# EAGLE design MSi001_board (EAGLE 9.6.2)
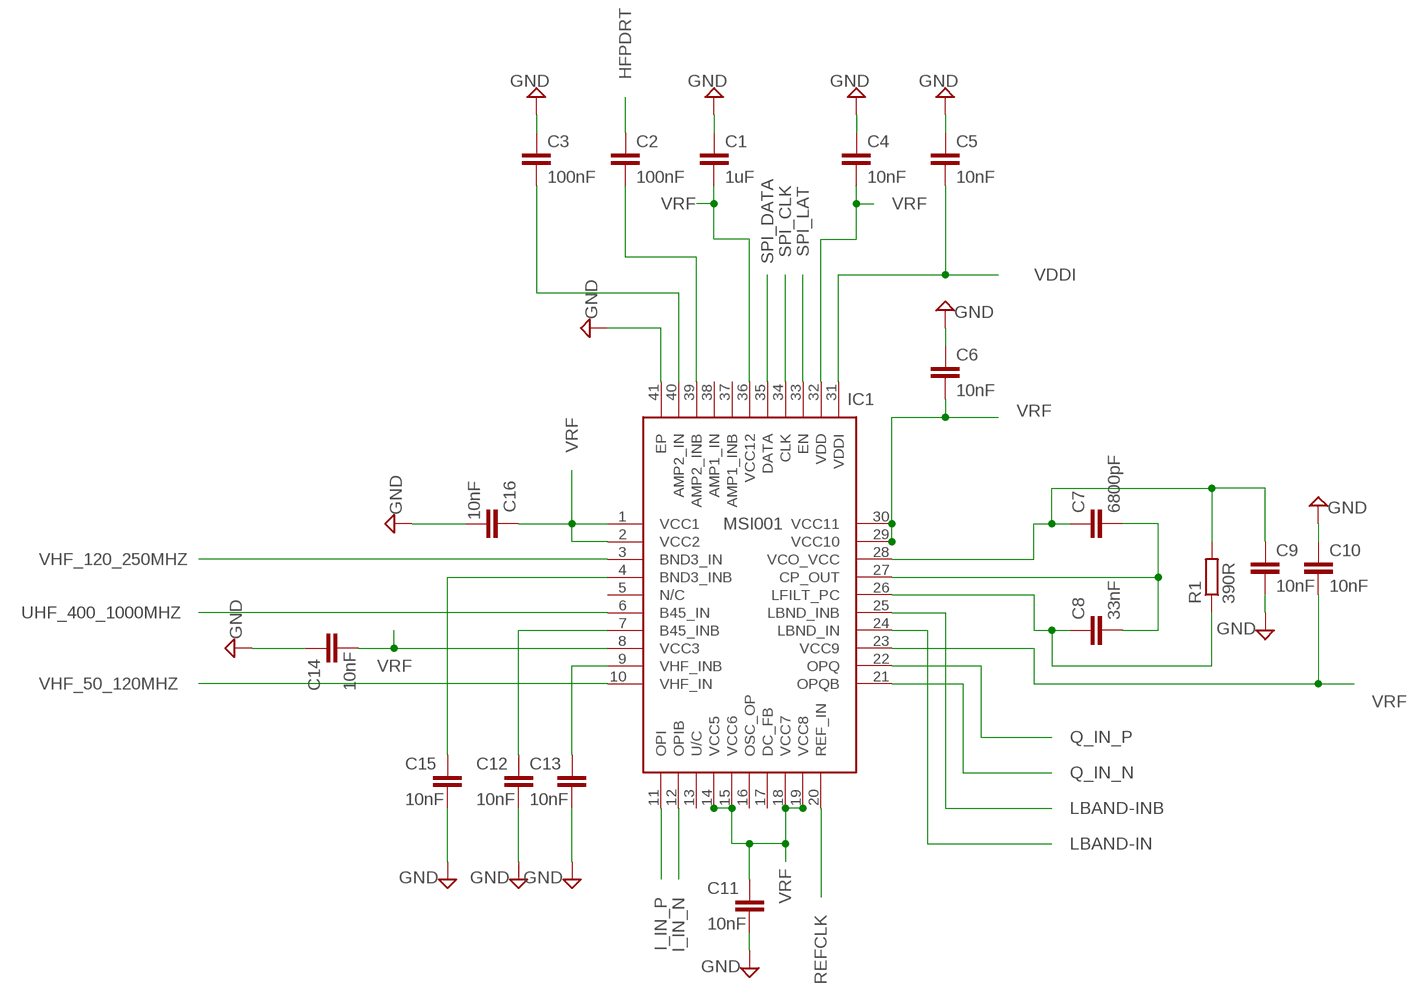
[diagram p0: schematic, sheet 1, part 1 of 2]
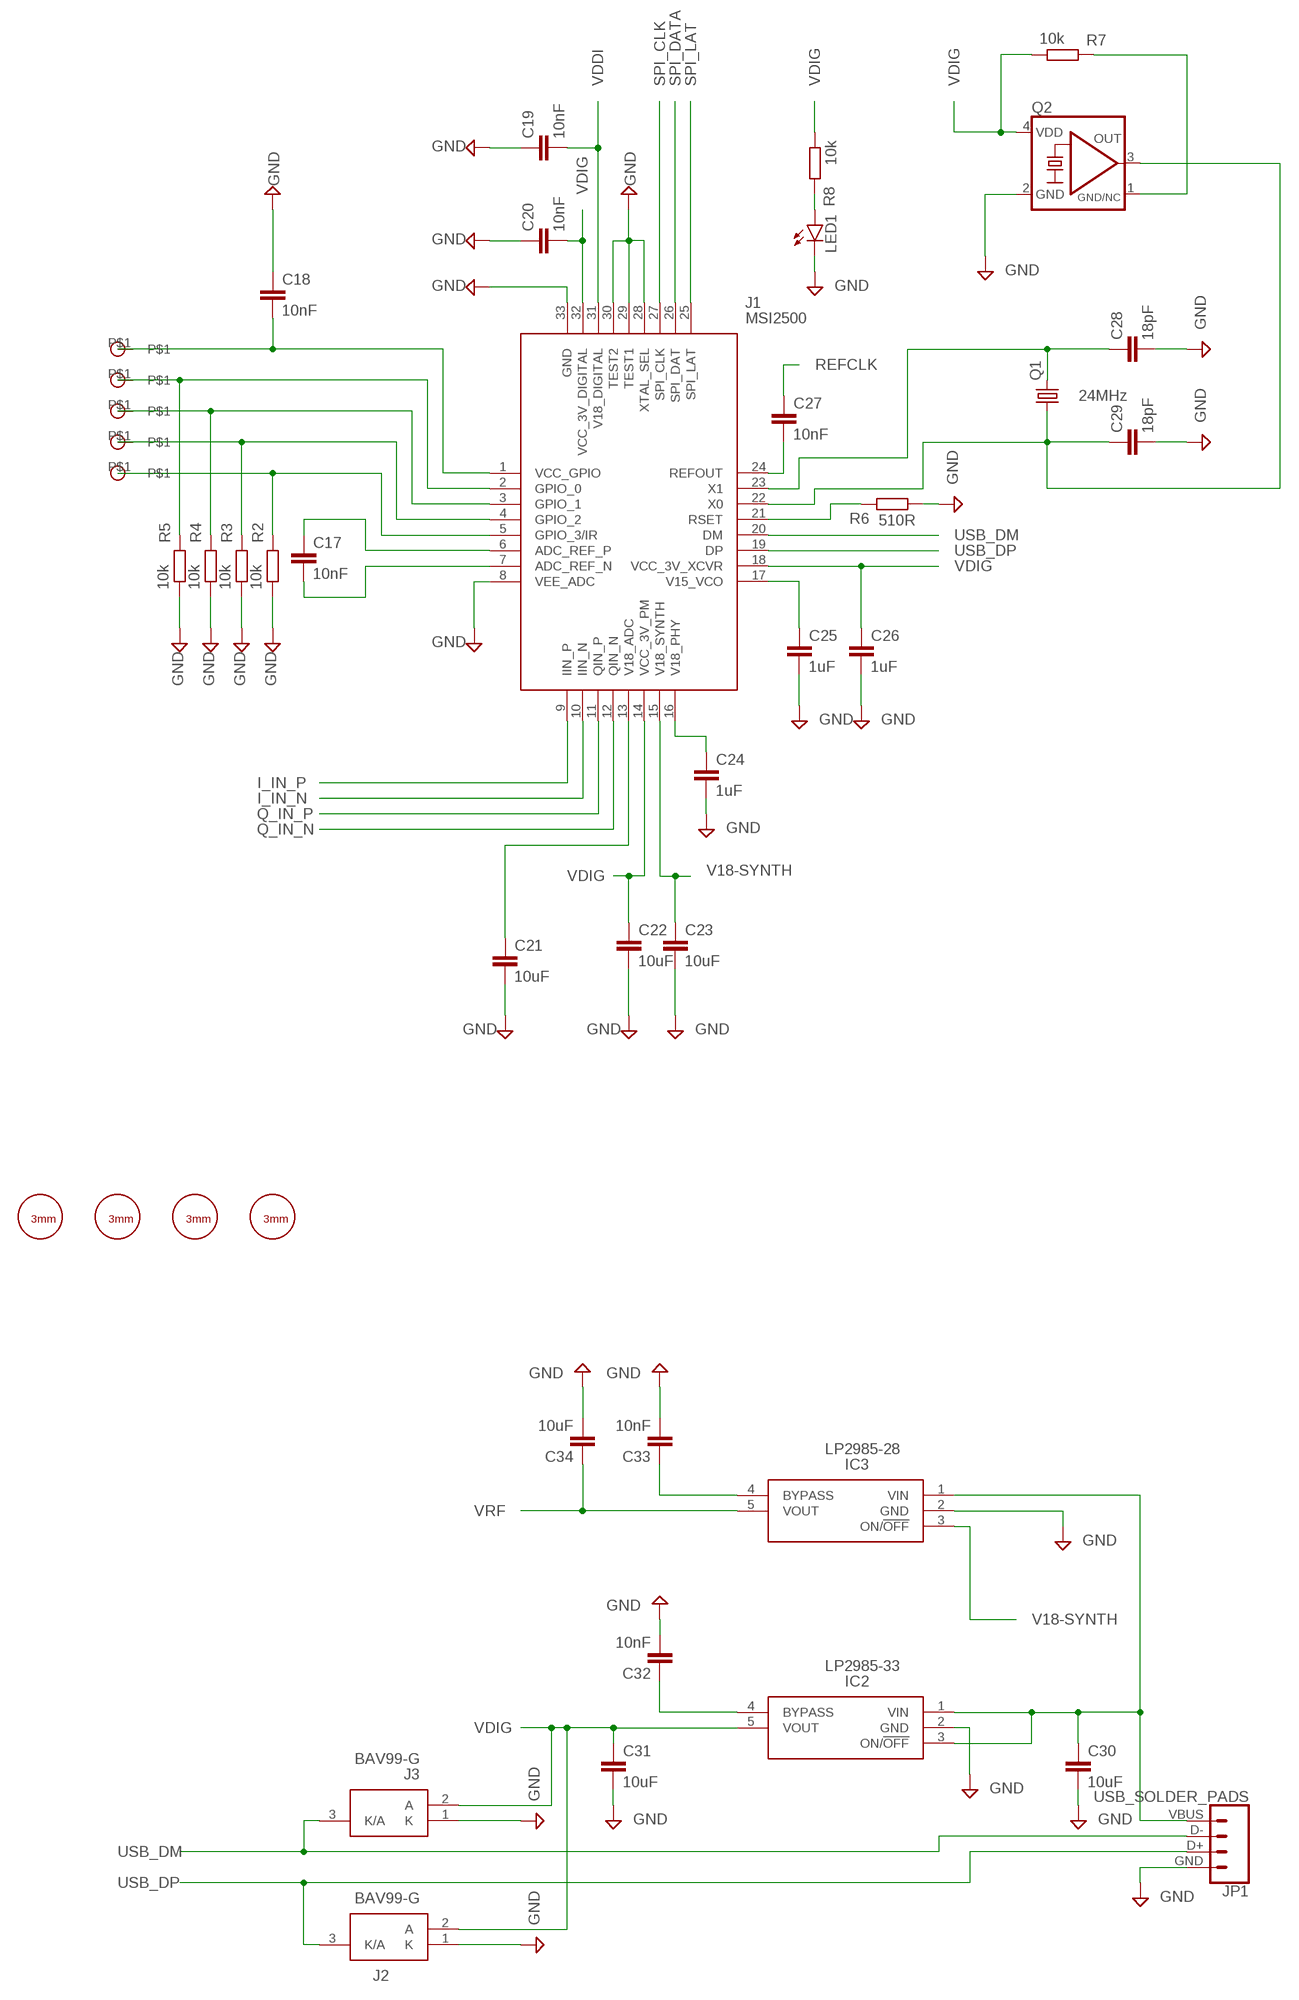
[diagram p1: schematic, sheet 1, part 2 of 2]

## Parts
C1  1uF  C-EUC0805K  [C0805K]
C2  100nF  C-EUC0603K  [C0603K]
C3  100nF  C-EUC0603K  [C0603K]
C4  10nF  C-EUC0603K  [C0603K]
C5  10nF  C-EUC0603K  [C0603K]
C6  10nF  C-EUC0603K  [C0603K]
C7  6800pF  C-EUC0603K  [C0603K]
C8  33nF  C-EUC0603K  [C0603K]
C9  10nF  C-EUC0603K  [C0603K]
C10  10nF  C-EUC0603K  [C0603K]
C11  10nF  C-EUC0603K  [C0603K]
C12  10nF  C-EUC0603K  [C0603K]
C13  10nF  C-EUC0603K  [C0603K]
C14  10nF  C-EUC0603K  [C0603K]
C15  10nF  C-EUC0603K  [C0603K]
C16  10nF  C-EUC0603K  [C0603K]
C17  10nF  C-EUC0603K  [C0603K]
C18  10nF  C-EUC0603K  [C0603K]
C19  10nF  C-EUC0603K  [C0603K]
C20  10nF  C-EUC0603K  [C0603K]
C21  10uF  C-EUC0805K  [C0805K]
C22  10uF  C-EUC0805K  [C0805K]
C23  10uF  C-EUC0805K  [C0805K]
C24  1uF  C-EUC0805K  [C0805K]
C25  1uF  C-EUC0805K  [C0805K]
C26  1uF  C-EUC0805K  [C0805K]
C27  10nF  C-EUC0603K  [C0603K]
C28  18pF  C-EUC0603K  [C0603K]
C29  18pF  C-EUC0603K  [C0603K]
C30  10uF  C-EUC0805K  [C0805K]
C31  10uF  C-EUC0805K  [C0805K]
C32  10nF  C-EUC0603K  [C0603K]
C33  10nF  C-EUC0603K  [C0603K]
C34  10uF  C-EUC0805K  [C0805K]
IC1  MSI001  [QFN50P600X600X90-41N]
IC2  LP2985-33  LP2985-30DBVR  [SOT95P280X145-5N]
IC3  LP2985-28  LP2985-30DBVR  [SOT95P280X145-5N]
J1  MSI2500  [QFN50P500X500X90-33N]
J2  BAV99-G  [SOT97P230X110-3N]
J3  BAV99-G  [SOT97P230X110-3N]
JP1  USB_SOLDER_PADS  [USB-SOLDER-PADS]
LED1  LEDCHIPLED_0805  [CHIPLED_0805]
Q1  24MHz  CRYSTALHC49S  [HC49/S]
Q2  KXO-TCXO-CMOS-83  [5.0X3.2_KXO-83-TCXO]
R1  390R  R-EU_R0603  [R0603]
R2  10k  R-EU_R0603  [R0603]
R3  10k  R-EU_R0603  [R0603]
R4  10k  R-EU_R0603  [R0603]
R5  10k  R-EU_R0603  [R0603]
R6  510R  R-EU_R0603  [R0603]
R7  10k  R-EU_R0603  [R0603]
R8  10k  R-EU_R0603  [R0603]
U$1  3MM_HOLE  [3MM_HOLE]
U$2  SMD_PIN  [SMD_PIN]
U$3  SMD_PIN  [SMD_PIN]
U$4  SMD_PIN  [SMD_PIN]
U$5  SMD_PIN  [SMD_PIN]
U$6  3MM_HOLE  [3MM_HOLE]
U$7  3MM_HOLE  [3MM_HOLE]
U$8  3MM_HOLE  [3MM_HOLE]
VCC_GPIO  SMD_PIN  [SMD_PIN]

## Nets
GND: C1.1 C3.1 C4.1 C5.1 C6.1 C9.2 C10.1 C11.2 C12.2 C13.2 C14.1 C15.2 C16.2 C18.1 C19.1 C20.1 C21.2 C22.2 C23.2 C24.2 C25.2 C26.2 C28.2 C29.2 C30.2 C31.2 C32.2 C33.2 C34.2 IC1.41(EP) IC2.2(GND) IC3.2(GND) J1.8(VEE_ADC) J1.28(XTAL_SEL) J1.29(TEST1) J1.30(TEST2) J1.33(GND) J2.1(K) J3.1(K) JP1.GND LED1.C Q2.2(GND) R2.1 R3.1 R4.1 R5.1 R6.1
HFPDRT: C2.1
I_IN_N: IC1.12(OPIB) J1.10(IIN_N)
I_IN_P: IC1.11(OPI) J1.9(IIN_P)
LBAND-IN: IC1.24(LBND_IN)
LBAND-INB: IC1.25(LBND_INB)
N$1: C2.2 IC1.39(AMP2_INB)
N$2: C3.2 IC1.40(AMP2_IN)
N$3: C7.1 C9.1 IC1.28(VCO_VCC) R1.2
N$4: C8.1 IC1.26(LFILT_PC) R1.1
N$5: C7.2 C8.2 IC1.27(CP_OUT)
N$6: C12.1 IC1.7(B45_INB)
N$7: C13.1 IC1.9(VHF_INB)
N$8: C15.1 IC1.4(BND3_INB)
N$9: C17.2 J1.7(ADC_REF_N)
N$10: C17.1 J1.6(ADC_REF_P)
N$11: C18.2 J1.1(VCC_GPIO) VCC_GPIO.P$1
N$12: J1.2(GPIO_0) R5.2 U$2.P$1
N$13: J1.3(GPIO_1) R4.2 U$3.P$1
N$14: J1.4(GPIO_2) R3.2 U$4.P$1
N$15: J1.5(GPIO_3/IR) R2.2 U$5.P$1
N$16: C21.1 J1.13(V18_ADC)
N$17: C24.1 J1.16(V18_PHY)
N$18: C25.1 J1.17(V15_VCO)
N$19: J1.21(RSET) R6.2
N$20: C27.2 J1.24(REFOUT)
N$21: C29.1 J1.22(X0) Q1.1 Q2.3(OUT)
N$22: C28.1 J1.23(X1) Q1.2
N$23: LED1.A R8.2
N$24: Q2.1(GND/NC) R7.2
N$25: C30.1 IC2.1(VIN) IC2.3(ON/!OFF) IC3.1(VIN) JP1.VBUS
N$26: C33.1 IC3.4(BYPASS)
N$27: C32.1 IC2.4(BYPASS)
Q_IN_N: IC1.21(OPQB) J1.12(QIN_N)
Q_IN_P: IC1.22(OPQ) J1.11(QIN_P)
REFCLK: C27.1 IC1.20(REF_IN)
SPI_CLK: IC1.34(CLK) J1.27(SPI_CLK)
SPI_DATA: IC1.35(DATA) J1.26(SPI_DAT)
SPI_LAT: IC1.33(EN) J1.25(SPI_LAT)
UHF_400_1000MHZ: IC1.6(B45_IN)
USB_DM: J1.20(DM) J3.3(K/A) JP1.D-
USB_DP: J1.19(DP) J2.3(K/A) JP1.D+
V18-SYNTH: C23.1 IC3.3(ON/!OFF) J1.15(V18_SYNTH)
VDDI: C5.2 C19.2 IC1.31(VDDI) J1.31(V18_DIGITAL)
VDIG: C20.2 C22.1 C26.1 C31.1 IC2.5(VOUT) J1.14(VCC_3V_PM) J1.18(VCC_3V_XCVR) J1.32(VCC_3V_DIGITAL) J2.2(A) J3.2(A) Q2.4(VDD) R7.1 R8.1
VHF_50_120MHZ: IC1.10(VHF_IN)
VHF_120_250MHZ: IC1.3(BND3_IN)
VRF: C1.2 C4.2 C6.2 C10.2 C11.1 C14.2 C16.1 C34.1 IC1.1(VCC1) IC1.2(VCC2) IC1.8(VCC3) IC1.14(VCC5) IC1.15(VCC6) IC1.18(VCC7) IC1.19(VCC8) IC1.23(VCC9) IC1.29(VCC10) IC1.30(VCC11) IC1.32(VDD) IC1.36(VCC12) IC3.5(VOUT)
Unconnected: IC1.5(N/C) IC1.13(U/C) IC1.16(OSC_OP) IC1.17(DC_FB) IC1.37(AMP1_INB) IC1.38(AMP1_IN)

## Library data of the parts
C1-C34 = rcl:C-EU: CAPACITOR, European symbol; SPICEPREFIX: C
IC1 = MSI001:MSI001: Multi-mode Tuner Source: Datasheet <http://sdr.lt/~hexx/MSi001_Datasheet_R3P3.pdf>; DESCRIPTION: Multi-mode Tuner; HEIGHT: 0.9mm; MANUFACTURER_NAME: MIRICS; MANUFACTURER_PART_NUMBER: MSI001
IC2 IC3 = LP2985-30DBVR:LP2985-30DBVR: 150-mA Low-noise Low-dropout Regulator With Shutdown Source: Datasheet <http://www.ti.com/lit/gpn/lp2985>; ARROW_PART_NUMBER: LP2985-30DBVR; ARROW_PRICE-STOCK: https://www.arrow.com/en/products/lp2985-30dbvr/texas-instruments; DESCRIPTION: 150-mA Low-noise Low-dropout Regulator With Shutdown; HEIGHT: 1.45mm; MANUFACTURER_NAME: Texas Instruments; MANUFACTURER_PART_NUMBER: LP2985-30DBVR; MOUSER_PART_NUMBER: 595-LP2985-30DBVR; MOUSER_PRICE-STOCK: https://www.mouser.co.uk/ProductDetail/Texas-Instruments/LP2985-30DBVR?qs=iSMark9AYDWJqjjCQuouOw%3D%3D
J1 = MSI2500:MSI2500: Mirics FlexiTVTM USB Interface IC Source: Datasheet <http://sdr.lt/~hexx/MSi2500.pdf>; DESCRIPTION: Mirics FlexiTVTM USB Interface IC; HEIGHT: 0.9mm; MANUFACTURER_NAME: MIRICS; MANUFACTURER_PART_NUMBER: MSI2500
J2 J3 = BAV99-G:BAV99-G: BAV99-G Source: Datasheet <https://4donline.ihs.com/images/VipMasterIC/IC/SENR/SENRS02123/SENRS02123-1.pdf?hkey=EF798316E3902B6ED9A73243A3159BB0>; DESCRIPTION: BAV99-G; HEIGHT: 1.1mm; MANUFACTURER_NAME: Sensitron Semiconductors; MANUFACTURER_PART_NUMBER: BAV99-G
JP1 = SparkFun-Connectors:USB_SOLDER_PADS: Solder pad access to USB pins. Helpful to expose on PCBs so user can attach external USB connector if necessary.
LED1 = led:LED: LED OSRAM: - CHIPLED LG R971, LG N971, LY N971, LG Q971, LY Q971, LO R971, LY R971 LH N974, LH R974 LS Q976, LO Q976, LY Q976 LO Q996 - Hyper CHIPLED LW Q18S LB Q993, LB Q99A, LB R99A - SideLED LS A670, LO A670, LY A670, LG A670, LP A670 LB A673, LV A673, LT A673, LW A673 LH A674 LY A675 LS A676, LA A676, LO A676, LY A676, LW A676 LS A679, LY A679, LG A679 - Hyper Micro SIDELED® LS Y876, LA Y876, LO Y876, LY Y876 LT Y87S - SmartLED LW L88C, LW L88S LB L89C, LB L89S, LG L890 LS L89K, LO L89K, LY L89K LS L896, LA L896, LO L896, LY L896 - TOPLED LS T670, LO T670, LY T670, LG T670, LP T670 LSG T670, LSP T670, LSY T670, LOP T670, LYG T670 LG T671, LOG T671, LSG T671 LB T673, LV T673, LT T673, LW T673 LH T674 LS T676, LA T676, LO T676, LY T676, LB T676, LH T676, LSB T676, LW T676 LB T67C, LV T67C, LT T67C, LS T67K, LO T67K, LY T67K, LW E67C LS E67B, LA E67B, LO E67B, LY E67B, LB E67C, LV E67C, LT E67C LW T67C LS T679, LY T679, LG T679 LS T770, LO T770, LY T770, LG T770, LP T770 LB T773, LV T773, LT T773, LW T773 LH T774 LS E675, LA E675, LY E675, LS T675 LS T776, LA T776, LO T776, LY T776, LB T776 LHGB T686 LT T68C, LB T68C - Hyper Mini TOPLED® LB M676 - Mini TOPLED Santana® LG M470 LS M47K, LO M47K, LY M47K Source: http://www.osram.convergy.de LUXEON: - LUMILED® LXK2-PW12-R00, LXK2-PW12-S00, LXK2-PW14-U00, LXK2-PW14-V00 LXK2-PM12-R00, LXK2-PM12-S00, LXK2-PM14-U00 LXK2-PE12-Q00, LXK2-PE12-R00, LXK2-PE12-S00, LXK2-PE14-T00, LXK2-PE14-U00 LXK2-PB12-K00, LXK2-PB12-L00, LXK2-PB12-M00, LXK2-PB14-N00, LXK2-PB14-P00, LXK2-PB14-Q00 LXK2-PR12-L00, LXK2-PR12-M00, LXK2-PR14-Q00, LXK2-PR14-R00 LXK2-PD12-Q00, LXK2-PD12-R00, LXK2-PD12-S00 LXK2-PH12-R00, LXK2-PH12-S00 LXK2-PL12-P00, LXK2-PL12-Q00, LXK2-PL12-R00 Source: www.luxeon.com KINGBRIGHT: KA-3528ASYC Source: www.kingbright.com
Q1 = crystal:CRYSTAL: CRYSTAL; OC_FARNELL: 1667008; OC_NEWARK: unknown
Q2 = crystal-geyer_V1_0:KXO-TCXO-CMOS: TCXO : CMOS - Serie Model Size l/w/h [mm] Frequency Range Frequency Stability Temp. Range [°C] Output AECQ 200 availabel Datasheet KXO-86 KXO-84 KXO-83 KXO-82 2.5/2.0/0.7 3.2/2.5/1.0 5.0/3.2/1.5 7.0/5.0/2.4 13,0 ~ 40,0 MHz 10,0 ~ 40,0 MHz 10,0 ~ 40,0 MHz 10,0 ~ 30,0 MHz ±1,0 … ±2,5ppm ±1,0 … ±2,5ppm ±1,0 … ±3,0ppm ±1,0 … ±3,0ppm (*) -30°C …+75°C (*) -40°C …+85°C (*) -40°C …+85°C (*) -30°C …+80°C CMOS CMOS CMOS CMOS - - - - KXO-86.pdf <http://www.geyer-electronic.de/uploads/tx_userartikelfrequenz/GEYER-KXO-86-TCXO-HCMOS.pdf> KXO-84.pdf <http://www.geyer-electronic.de/uploads/tx_userartikelfrequenz/GEYER-KXO-84-TCXO-HCMOS.pdf> KXO-83.pdf <http://www.geyer-electronic.de/uploads/tx_userartikelfrequenz/GEYER-KXO-83-TCXO-HCMOS.pdf> KXO-82.pdf <http://www.geyer-electronic.de/uploads/tx_userartikelfrequenz/GEYER-KXO-82-TCXO-HCMOS.pdf> <http://www.geyer-electronic.de/fileadmin/template/img/logo-geyer-electronic.png> Details see: http://www.geyer-electronic.de/Frequenz-Produkte.9.0.html Created 2016-06-07, Hans Locher 2016 (C) Geyer Quartz Technology KXO86,KXO84,KXO83,KXO82;2550;3225;5032;7050;2,5x2,0;3,2x2,5;2.5x2.0;3.2x2.5,5,0x3,2;7,0x5,0,5.0x3.2,7.0x5.0
R1-R8 = rcl:R-EU_: RESISTOR, European symbol; SPICEPREFIX: R
U$1 U$6-U$8 = mylib:3MM_HOLE
U$2-U$5 VCC_GPIO = mylib:SMD_PIN

## Board
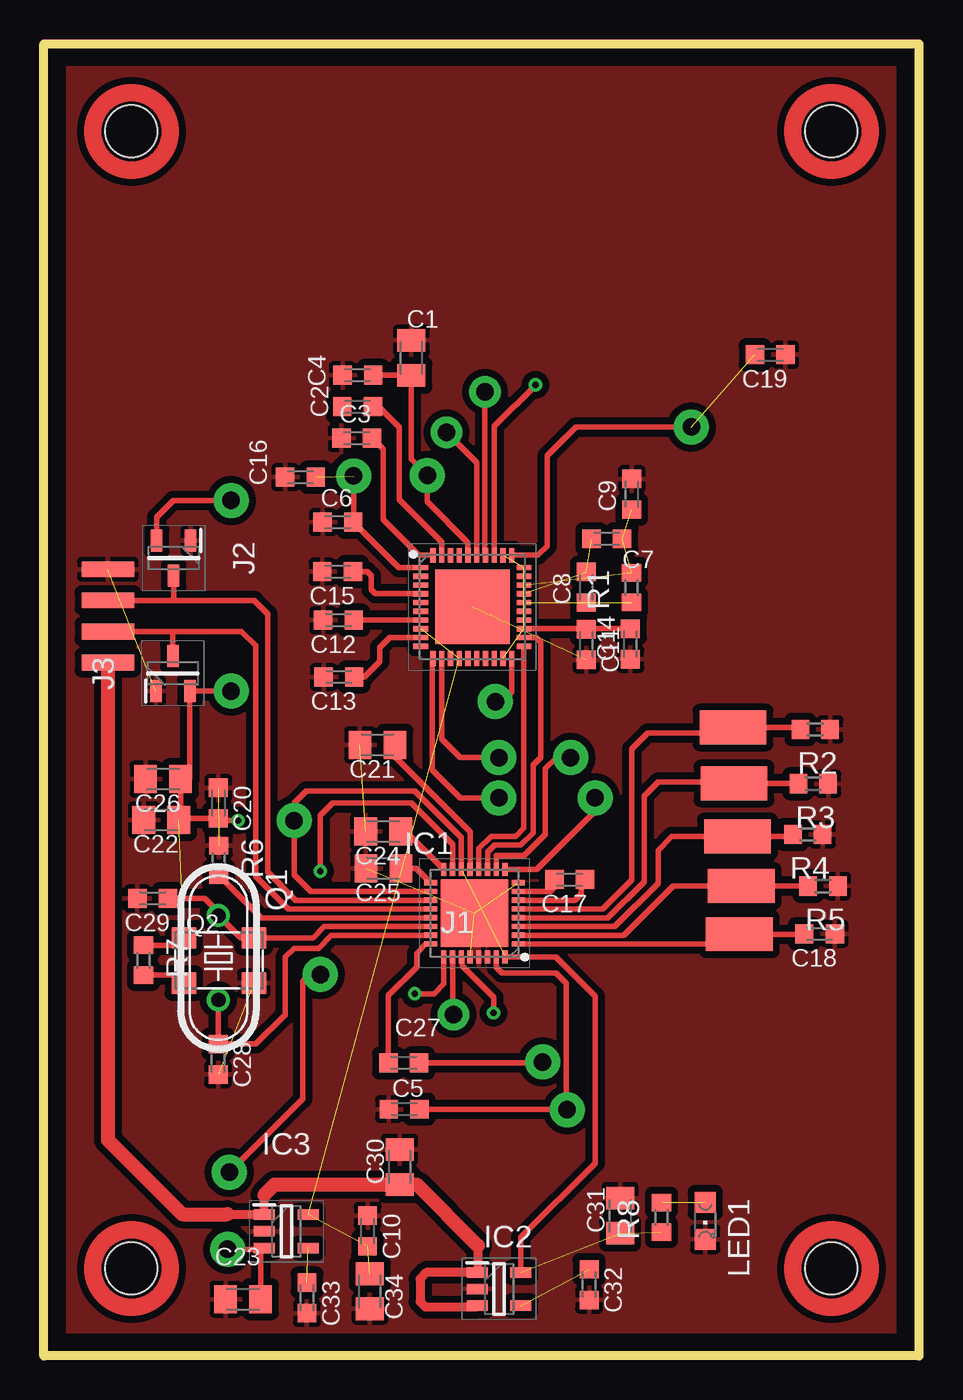
[diagram p2: board, top side]
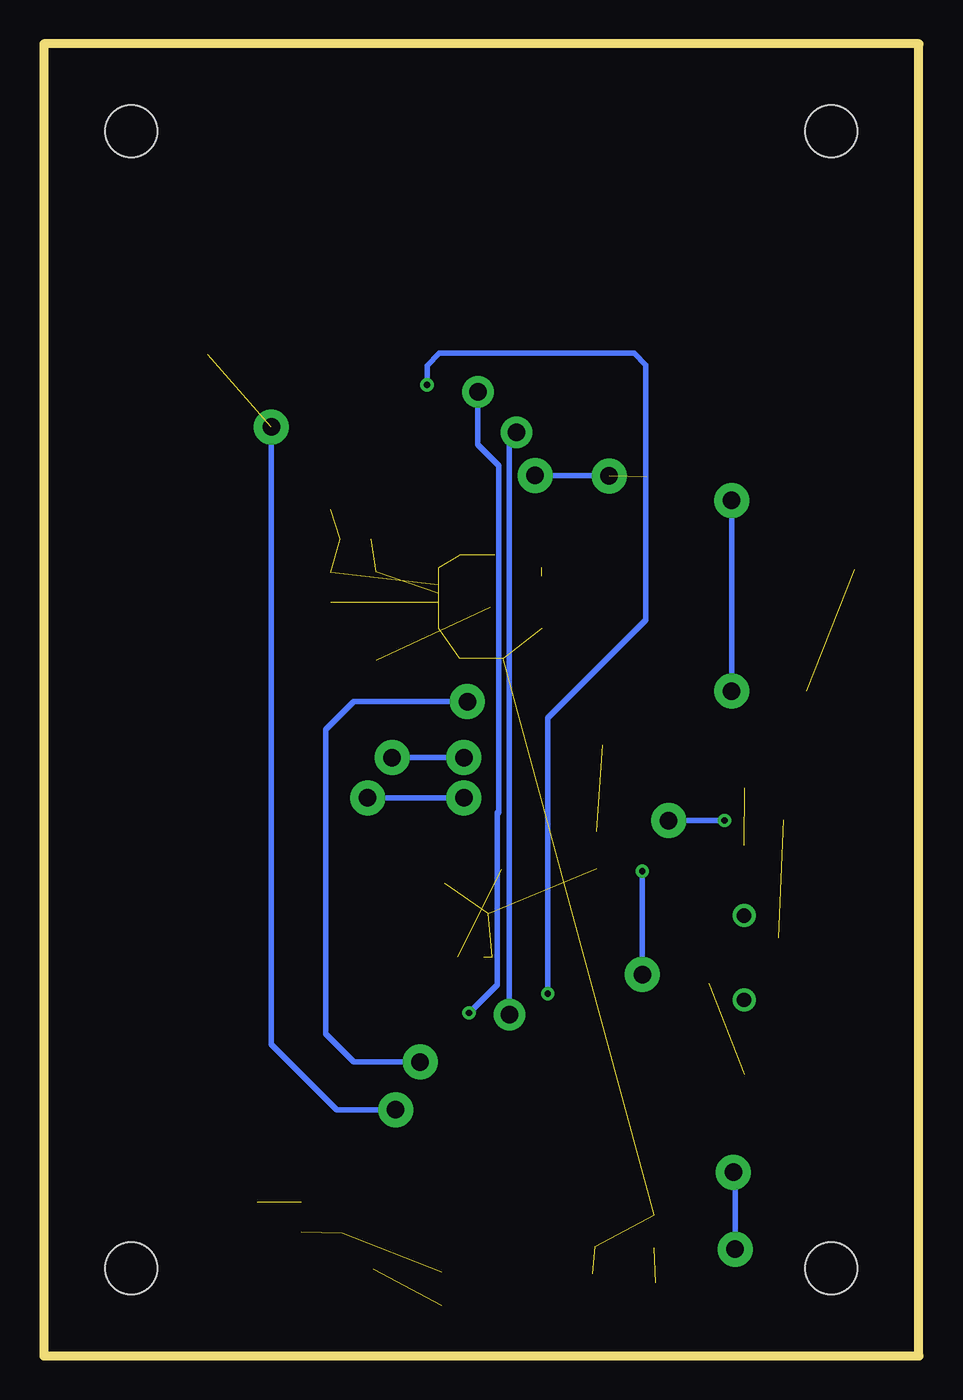
[diagram p3: board, bottom side, seen from below]

Size 50 x 75 mm. Coordinates in mm from the lower left corner, seen from the top.
Outline: 0,0 0,75 50,75 50,0 0,0
Copper layers (1*16): Top 0.035mm / dielectric 1.5mm / Bottom 0.035mm
Design rules "default": minimum track width 6mil, minimum drill 0.35mm, track to track 6mil, track to pad 6mil, pad to pad 6mil, via to via 6mil, smd to smd 6mil, copper to edge 40mil, drill to drill 6mil, minimum pad ring 10mil, minimum via ring 8mil, stop-mask expansion 4mil, vias tented up to drill 0mil, thermal gap 10mil

### Footprints (pad centres in the part's own frame; a part is rotated, then mirrored left to right if it is on the bottom)
C0805K = smd 1.3 x 1.6: 1 -1,0; 2 1,0
C0603K = smd 1.05 x 1.08: 1 -0.875,0; 2 0.875,0
QFN50P600X600X90-41N = smd 0.85 x 0.3: 1 -2.95,2.25; 2 -2.95,1.75; 3 -2.95,1.25; 4 -2.95,0.75; 5 -2.95,0.25; 6 -2.95,-0.25; 7 -2.95,-0.75; 8 -2.95,-1.25; 9 -2.95,-1.75; 10 -2.95,-2.25; 21 2.95,-2.25; 22 2.95,-1.75; 23 2.95,-1.25; 24 2.95,-0.75; 25 2.95,-0.25; 26 2.95,0.25; 27 2.95,0.75; 28 2.95,1.25; 29 2.95,1.75; 30 2.95,2.25 | smd 0.3 x 0.85: 11 -2.25,-2.95; 12 -1.75,-2.95; 13 -1.25,-2.95; 14 -0.75,-2.95; 15 -0.25,-2.95; 16 0.25,-2.95; 17 0.75,-2.95; 18 1.25,-2.95; 19 1.75,-2.95; 20 2.25,-2.95; 31 2.25,2.95; 32 1.75,2.95; 33 1.25,2.95; 34 0.75,2.95; 35 0.25,2.95; 36 -0.25,2.95; 37 -0.75,2.95; 38 -1.25,2.95; 39 -1.75,2.95; 40 -2.25,2.95 | smd 4.25 x 4.25: 41 0,0
SOT95P280X145-5N = smd 1.2 x 0.6: 1 -1.25,0.95; 2 -1.25,0; 3 -1.25,-0.95; 4 1.25,-0.95; 5 1.25,0.95
QFN50P500X500X90-33N = smd 0.75 x 0.3: 1 -2.5,1.75; 2 -2.5,1.25; 3 -2.5,0.75; 4 -2.5,0.25; 5 -2.5,-0.25; 6 -2.5,-0.75; 7 -2.5,-1.25; 8 -2.5,-1.75; 17 2.5,-1.75; 18 2.5,-1.25; 19 2.5,-0.75; 20 2.5,-0.25; 21 2.5,0.25; 22 2.5,0.75; 23 2.5,1.25; 24 2.5,1.75 | smd 0.3 x 0.75: 9 -1.75,-2.5; 10 -1.25,-2.5; 11 -0.75,-2.5; 12 -0.25,-2.5; 13 0.25,-2.5; 14 0.75,-2.5; 15 1.25,-2.5; 16 1.75,-2.5; 25 1.75,2.5; 26 1.25,2.5; 27 0.75,2.5; 28 0.25,2.5; 29 -0.25,2.5; 30 -0.75,2.5; 31 -1.25,2.5; 32 -1.75,2.5 | smd 3.85 x 3.85: 33 0,0
SOT97P230X110-3N = smd 1.25 x 0.65: 1 -1,0.97; 2 -1,-0.97; 3 1,0
USB-SOLDER-PADS = smd 3 x 0.9: D+ 0,-0.889; D- 0,0.889; GND 0,-2.667; VBUS 0,2.667
CHIPLED_0805 = smd 1.2 x 1.2: A 0,-1.05; C 0,1.05
HC49/S = drill 0.813: 1 -2.413,0; 2 2.413,0
5.0X3.2_KXO-83-TCXO = smd 1.4 x 1.2: 1 -2,-1.3; 2 2,-1.3; 3 2,1.3; 4 -2,1.3
R0603 = smd 1 x 1.1: 1 -0.85,0; 2 0.85,0
3MM_HOLE = hole 3: 0,0
SMD_PIN = smd 1.93 x 3.81: P$1 0,0

### Placement (x,y rotation side)
C1  21,57.05 270 top
C2  17.93,54.25 0 top
C3  17.88,52.45 0 top
C4  17.95,56.05 0 top
C5  20.59,14.1 0 top
C6  16.81,47.65 0 top
C7  32.17,46.7 180 top
C8  31,43.93 90 top
C9  33.6,49.25 90 top
C10  18.5,7.13 270 top
C11  31,40.66 270 top
C12  16.84,42.05 180 top
C13  16.87,38.8 180 top
C14  33.52,40.69 90 top
C15  16.79,44.82 180 top
C16  14.67,50.22 180 top
C17  30.05,27.22 180 top
C18  44.33,24.12 180 top
C19  41.51,57.22 180 top
C20  9.98,31.59 270 top
C21  19.07,34.92 180 top
C22  6.71,30.64 180 top
C23  11.39,3.24 180 top
C24  19.4,29.96 180 top
C25  19.41,27.86 180 top
C26  6.82,32.96 180 top
C27  20.57,16.74 180 top
C28  9.96,16.95 270 top
C29  6.23,26.14 180 top
C30  20.34,10.79 90 top
C31  32.94,8.01 90 top
C32  31.16,4.07 270 top
C33  15.04,3.31 270 top
C34  18.64,3.69 270 top
IC1  24.49,42.81 0 top
IC2  26.02,3.82 0 top
IC3  13.86,7.12 0 top
J1  24.61,25.29 180 top
J2  7.42,45.6 270 top
J3  7.38,39.01 90 top
JP1  3.66,42.29 180 top
LED1  37.8,7.72 180 top
Q1  9.98,22.75 270 top
Q2  10,22.6 0 top
R1  33.59,43.92 90 top
R2  44.09,35.8 180 top
R3  43.97,32.7 180 top
R4  43.65,29.8 180 top
R5  44.53,26.85 180 top
R6  10,28.31 270 top
R7  5.7,22.61 270 top
R8  35.3,7.91 90 top
U$1  5,5 0 top
U$2  39.86,26.86 90 top
U$3  39.64,29.68 270 top
U$4  39.44,32.72 270 top
U$5  39.39,35.91 270 top
U$6  45,5 0 top
U$7  5,70 0 top
U$8  45,70 0 top
VCC_GPIO  39.74,24.1 270 top

### Tracks (layer width: path | path; a pad name or v marks a point on that pad's centre or on a via)
GND  (9 unrouted)
  pour Top (isolate 0.4): 52.6,-3 -2.5,-3 -2.5,77.9 52.6,77.9
I_IN_N  (via drill 1 pad 2)
  Top 0.305: J1.10 25.86,28.59 27.46,28.59 28.66,29.79 28.66,33.56 29.3,34.2 v30.1,34.2 | IC1.12 22.74,35.26 23.8,34.2 v26,34.2
  Bottom 0.305: v30.1,34.2 v26,34.2
I_IN_P  (via drill 1 pad 2)
  Top 0.305: J1.9 28.16,27.79 31.5,31.13 v31.5,31.9 | IC1.11 22.2,39.82 22.2,33.5 23.8,31.9 v26,31.9
  Bottom 0.305: v31.5,31.9 v26,31.9
N$1
  Top 0.305: IC1.39 22.74,46.51 20.3,48.95 20.3,53.1 19.15,54.25 C2.2
N$2
  Top 0.305: IC1.40 21.44,45.76 19.4,47.8 19.4,51.84 18.79,52.45 C3.2
N$3  (3 unrouted)
N$4  (2 unrouted)
N$5  (2 unrouted)
N$6
  Top 0.305: C12.1 IC1.7
N$7
  Top 0.305: C13.1 18.3,38.8 19.2,39.7 19.2,40.5 19.76,41.06 IC1.9
N$8
  Top 0.305: IC1.4 18.94,43.56 18.7,43.8 18.7,44.6 18.48,44.82 C15.1
N$9
  Top 0.305: J1.7 28.94,26.54 29.2,26.8 29.2,27.2 C17.2
N$10
  Top 0.305: J1.6 30.34,26.04 30.7,26.4 30.7,27.22 C17.1
N$11
  Top 0.305: J1.1 39.18,23.54 VCC_GPIO.P$1 43.44,24.1 C18.2
N$12
  Top 0.305: J1.2 33.14,24.04 35.96,26.86 U$2.P$1 R5.2
N$13
  Top 0.305: J1.3 32.64,24.54 35.1,27 35.1,28.9 35.88,29.68 U$3.P$1 42.68,29.68 R4.2
N$14
  Top 0.305: J1.4 32.24,25.04 34.3,27.1 34.3,32 35.1,32.8 40.5,32.8 40.7,32.6 39.56,32.6 U$4.P$1 43.1,32.72 R3.2
N$15
  Top 0.305: J1.5 31.94,25.54 33.6,27.2 33.6,34.7 34.5,35.6 40.1,35.6 39.79,35.91 U$5.P$1 43.13,35.91 R2.2
N$16
  Top 0.305: J1.13 24.36,29.94 20.1,34.2 20.07,34.2 C21.1
N$17
  Top 0.305: J1.16 20.69,29.96 C24.1
N$18
  Top 0.305: J1.17 21.29,27.86 C25.1
N$19
  Top 0.305: J1.21 12.42,25.04 R6.2
N$20
  Top 0.305: J1.24 21.84,23.54 21.3,23 21.3,22.2 19.7,20.59 C27.2
N$21
  Top 0.305: C29.1 9.2,26.14 9.98,25.36 Q1.1 11.24,23.9 Q2.3 15.4,23.9 16.04,24.54 J1.22
N$22
  Top 0.305: J1.23 16.44,24.04 15.7,23.3 14.3,23.3 13.8,22.8 13.8,19.5 12.12,17.82 C28.1 9.98,17.84 Q1.2
N$23  (1 unrouted)
N$24
  Top 0.305: R7.2 7.54,21.76 Q2.1
N$25
  Top 0.508: 10.5,8.1 12.58,8.1 IC3.1 12.61,9.19 12.6,9.2 | 24.8,6.3 24.8,4.8 IC2.1 21.87,4.77 21.5,4.4 21.5,3.1 21.8,2.8 24.7,2.8 IC2.3
  Top 0.813: JP1.VBUS 3.66,12.34 7.9,8.1 10.5,8.1 | 12.6,9.2 13.19,9.79 C30.1 21.31,9.79 24.8,6.3
N$26  (1 unrouted)
N$27  (1 unrouted)
Q_IN_N
  Top 0.305: J1.12 24.86,28.99 25.56,29.69 26.96,29.69 27.44,30.17 IC1.21
Q_IN_P
  Top 0.305: IC1.22 28.14,41.06 28.4,40.8 28.4,34.2 27.96,33.76 27.96,29.89 27.26,29.19 25.76,29.19 25.36,28.79 J1.11
REFCLK  (via drill 1 pad 2)
  Top 0.305: IC1.20 26.74,37.94 26.2,37.4 v25.8,37.4 | C27.1 28.44,16.74 v28.5,16.8
  Bottom 0.305: v28.5,16.8 32.3,16.8 33.9,18.4 33.9,35.8 32.3,37.4 v25.8,37.4
SPI_CLK  (via drill 0.35, 1 pad 1.8)
  Top 0.305: J1.27 23.91,22.75 23.91,22.29 25.7,20.49 v25.7,19.6 | v25.2,55.1 25.2,45.8 IC1.34
  Bottom 0.305: v25.7,19.6 24.1,21.2 24.1,31.05 24.05,31 24,31.06 24,50.9 25.2,52.1 v25.2,55.1
SPI_DATA  (via drill 1 pad 1.8)
  Top 0.305: IC1.35 24.74,51.06 v23,52.8 | J1.26 23.36,19.54 v23.4,19.5
  Bottom 0.305: v23.4,19.5 23.4,52.4 v23,52.8
SPI_LAT  (via drill 0.35)
  Top 0.305: IC1.33 25.74,53.14 v28.1,55.5 | v21.2,20.7 22.3,20.7 22.86,21.26 J1.25
  Bottom 0.305: v28.1,55.5 28.1,56.6 27.4,57.3 16.26,57.3 15.6,56.64 15.6,42.06 21.2,36.45 v21.2,20.7
USB_DM
  Top 0.305: J1.20 13.96,25.54 12.1,27.4 12.1,40.6 11.3,41.4 JP1.D- 7.4,41.4 7.38,41.38 J3.3
USB_DP
  Top 0.305: 7.3,43.18 12.02,43.18 12.8,42.4 12.8,27.65 14.41,26.04 J1.19 | 7.3,43.18 JP1.D+ | J2.3 7.42,43.3 7.3,43.18
V18-SYNTH  (via drill 0.35, 1 pad 2)
  Top 0.305: C23.1 12.39,5.95 IC3.3 12.54,6.1 v10.5,6.1 | v10.6,10.5 14.8,14.7 14.8,21.4 15.2,21.8 v15.8,21.8 | v15.8,27.7 15.8,30.9 16.5,31.6 21,31.6 23.36,29.24 J1.15
  Bottom 0.305: v10.5,6.1 10.5,10.4 v10.6,10.5 | v15.8,27.7 v15.8,21.8
VDDI  (via drill 1 pad 2)  (1 unrouted)
  Top 0.305: J1.31 25.86,22.19 26.16,21.89 29.26,21.89 29.86,21.29 29.86,14.11 v29.9,14.06 29.86,14.1 C5.2 | v37,53.1 30.4,53.1 28.76,51.46 28.76,46.28 28.24,45.76 IC1.31
  Bottom 0.305: v37,53.1 37,17.8 33.27,14.06 v29.9,14.06 30,14.06
VDIG  (via drill 0.35, 1 pad 2)  (4 unrouted)
  Top 0.305: J1.18 15.26,26.54 14.3,27.5 v14.3,30.6 14.3,31.6 15,32.3 21.2,32.3 23.86,29.64 J1.14 | v11.1,30.6 10.1,30.6 C20.2 7.79,30.71 C22.1 7.82,30.75 C26.1 8.35,32.96 J3.2 10.59,38.01 10.6,38 v10.7,38 | v10.7,48.9 7.4,48.9 6.45,47.95 J2.2 | R7.1 7.56,23.46 Q2.4 | IC2.5 27.27,6.77 31.5,11 31.5,20.55 29.26,22.79 J1.32
  Bottom 0.305: v14.3,30.6 v11.1,30.6 | v10.7,38 v10.7,48.9
VRF  (via drill 1 pad 2)  (14 unrouted)
  Top 0.305: IC1.1 20.27,45.06 C6.2 17.7,47.66 v17.7,50.3 | IC1.36 24.24,46.49 21.91,48.83 21.91,50.3 v21.93,50.33 21,51.25 C1.2 C4.2 | IC1.23 30.98,41.56 C11.1 31.03,41.56 C14.2
  Bottom 0.305: v21.93,50.33 17.73,50.33 v17.7,50.3